# EAGLE design ArduinoStripShield (EAGLE 7.7.0)
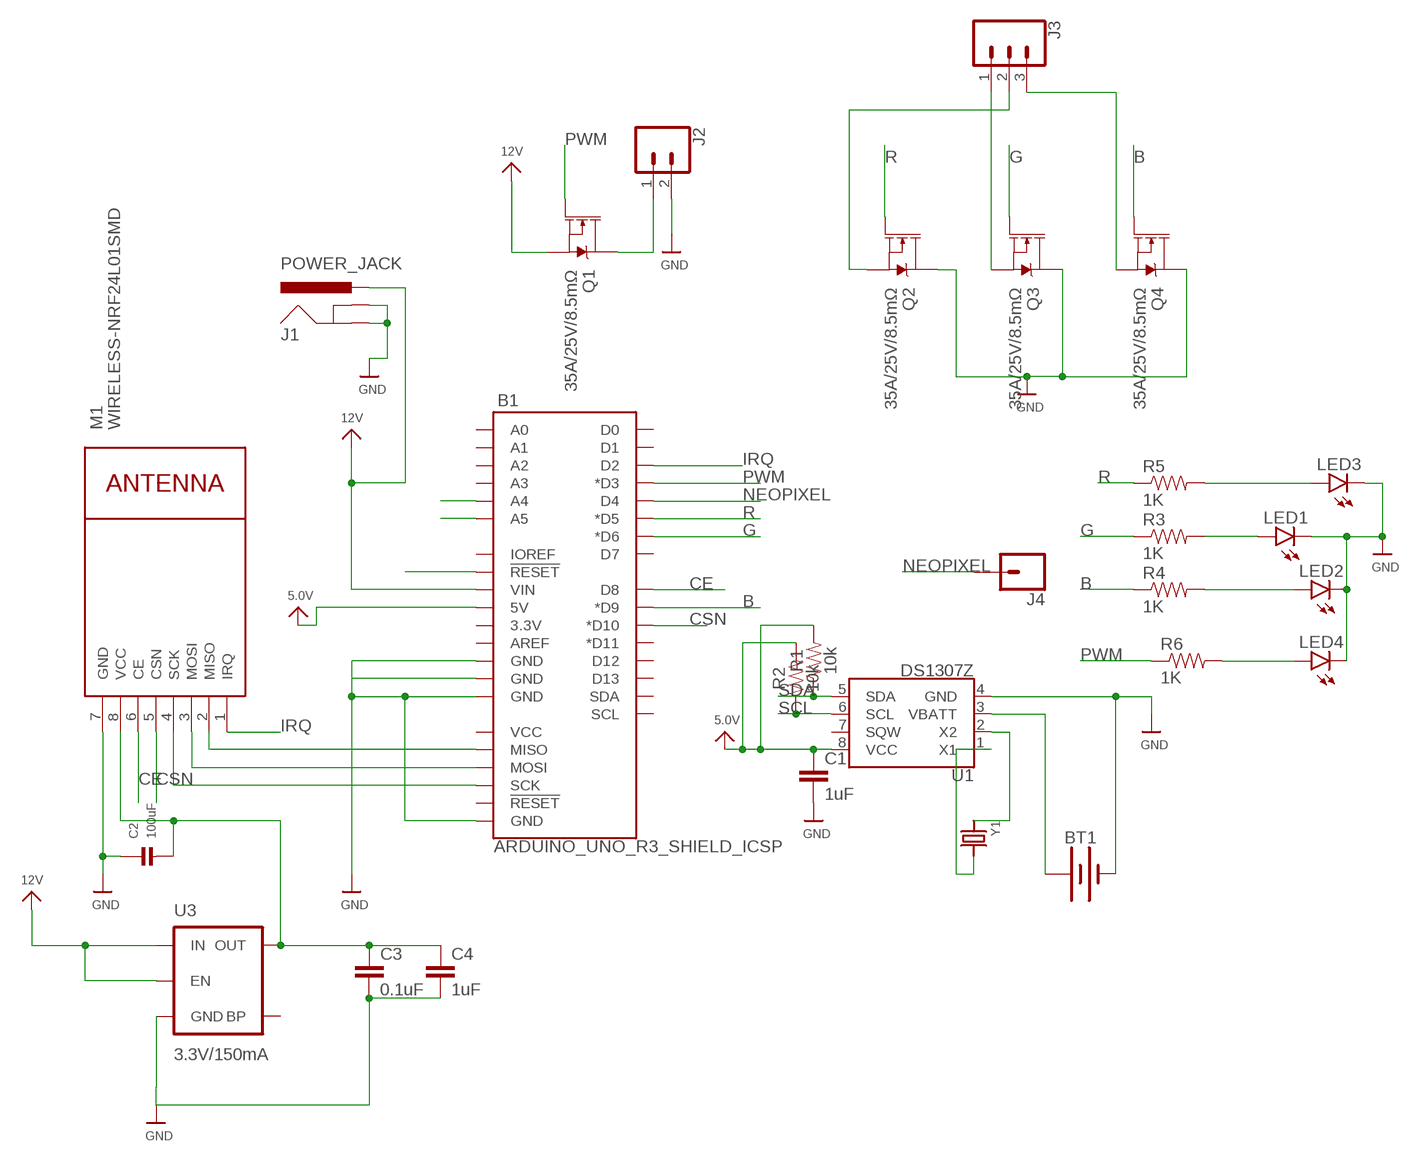
[diagram p0: schematic, sheet 1]

## Parts
B1  ARDUINO_UNO_R3_SHIELD_ICSP  [UNO_R3_SHIELD_ICSP]
BT1  BATTERY-12MM_SMD  [BATTCON_12MM]
C1  1uF  CAP  [0805]
C2  100uF  CAP_CERAMIC1206  [1206]
C3  0.1uF  CAP  [0805]
C4  1uF  CAP  [0805]
J1  POWER_JACK  [POWER_JACK_PTH]
J2  CONN_02  [1X02]
J3  CONN_03  [1X03]
J4  CONN_01  [1X01]
LED1  LED0603  [LED-0603]
LED2  LED0603  [LED-0603]
LED3  LED0603  [LED-0603]
LED4  LED0603  [LED-0603]
M1  WIRELESS-NRF24L01SMD  [WIRELESS-NRF24L01-SMD]
Q1  35A/25V/8.5mΩ  MOSFET-NCH-FDD8780  [DPAK]
Q2  35A/25V/8.5mΩ  MOSFET-NCH-FDD8780  [DPAK]
Q3  35A/25V/8.5mΩ  MOSFET-NCH-FDD8780  [DPAK]
Q4  35A/25V/8.5mΩ  MOSFET-NCH-FDD8780  [DPAK]
R1  10k  10KOHM-0603-1/10W-1%  [0603]
R2  10k  10KOHM-0603-1/10W-1%  [0603]
R3  1K  1KOHM-1/10W-1%(0603)  [0603-RES]
R4  1K  1KOHM-1/10W-1%(0603)  [0603-RES]
R5  1K  1KOHM-1/10W-1%(0603)  [0603-RES]
R6  1K  1KOHM-1/10W-1%(0603)  [0603-RES]
U1  DS1307Z  [SO08-0.15]
U3  3.3V/150mA  V_REG_MIC52053.3V  [SOT23-5]
Y1  CRYSTAL8X3.8SMT  [CRYSTAL_8X3.8]

## Nets
5.0V: B1.5V C1.1 R1.2 R2.2 U1.8(VCC)
12V: B1.VIN J1.PWR Q1.3(S) U3.1(IN) U3.3(EN)
B: B1.D9(*D9) Q4.1(G) R4.1
CE: B1.D8 M1.6(CE)
CSN: B1.D10(*D10) M1.5(CSN)
G: B1.D6(*D6) Q3.1(G) R3.1
GND: B1.GND@0(GND) B1.GND@1(GND) B1.GND@2(GND) B1.GND_ICSP(GND) BT1.GND(-) C1.2 C2.1 C3.2 C4.2 J1.GND J1.GNDBREAK J2.2 LED1.C LED2.C LED3.C LED4.C M1.7(GND) Q2.4(D) Q3.4(D) Q4.4(D) U1.4(GND) U3.2(GND)
IRQ: B1.D2 M1.1(IRQ)
N$1: J2.1 Q1.4(D)
N$2: B1.MISO M1.2(MISO)
N$3: B1.MOSI M1.3(MOSI)
N$4: J3.1 Q3.3(S)
N$5: J3.2 Q2.3(S)
N$6: J3.3 Q4.3(S)
N$7: BT1.PWR@1(+) U1.3(VBATT)
N$8: U1.2(X2) Y1.P$1
N$9: U1.1(X1) Y1.P$4
N$10: B1.SCK M1.4(SCK)
N$11: C2.2 C3.1 C4.1 M1.8(VCC) U3.5(OUT)
N$12: LED2.A R4.2
N$13: LED4.A R6.2
N$16: LED3.A R5.2
N$17: LED1.A R3.2
NEOPIXEL: B1.D4 J4.1
PWM: B1.D3(*D3) Q1.1(G) R6.1
R: B1.D5(*D5) Q2.1(G) R5.1
RST: B1.RES(!RESET!)
SCL: B1.A5 R2.1 U1.6(SCL)
SDA: B1.A4 R1.1 U1.5(SDA)
Unconnected: B1.3.3V B1.5V_ICSP(VCC) B1.A0 B1.A1 B1.A2 B1.A3 B1.AREF B1.D7 B1.D11(*D11) B1.D12 B1.D13 B1.IOREF B1.RST_ICSP(!RESET!) B1.RX(D0) B1.SCL B1.SDA B1.TX(D1) U1.7(SQW) U3.4(BP)

## Library data of the parts
B1 = SparkFun-Boards:ARDUINO_UNO_R3_SHIELD_ICSP: Arduino R3 Shield Footprint with ICSP Header Includes pins for 6-pin (2x3) ICSP Header. Compatible with Leonardo boards that require SPI pin connections via this header. SparkFun Products: CryptoShield <https://www.sparkfun.com/products/13183> microSD Shield <https://www.sparkfun.com/products/12761> R3 Stackable Headers Kit <https://www.sparkfun.com/products/1417>
BT1 = SparkFun-Batteries:BATTERY: Battery - Single Cell A variety of battery chemistries, sizes, and footprints. Device List: 20MM_PTH - Coin Cell Battery Holder - 20mm (PTH) <https://www.sparkfun.com/products/783> 12MM_SMD - Coin Cell Battery Holder - 12mm (SMD) <https://www.sparkfun.com/products/10592> 12MM_PTH - Coin Cell Battery Holder - 12mm (PTH) <https://www.sparkfun.com/products/7948> 20MM_SMD - 20mm Coin Cell Battery Holder (SMD) (2 legs) Used on the Big Time Watch Kit <https://www.sparkfun.com/products/11734> 20MM_SMD_4LEGS - Coin Cell Battery Holder - 20mm (SMD) <https://www.sparkfun.com/products/11892> 20MM_SMD_4LEGS_OVERPASTE - Coin Cell Battery Holder - 20mm (SMD) <https://www.sparkfun.com/products/11892> (Over-paste on the legs) 24.5MM_PTH - Coin Cell Battery Holder - 24.5mm (PTH) <https://www.sparkfun.com/products/8863> 9V - 9V Battery Holder - PC Mount Used on the SparkFun SparkPunk Sound Kit <https://www.sparkfun.com/products/11177> and SparkFun SparkPunk Sequencer Kit <https://www.sparkfun.com/products/12707> 18650 - Battery Holder - 18650 (PTH) <https://www.sparkfun.com/products/13113> AA - Battery Holder - 1xAA (PTH) <https://www.sparkfun.com/products/7949> AAA - Battery Holder - 1xAAA (PTH) <https://www.sparkfun.com/products/12718> AA_KIT - Battery Holder - 1xAA (PTH) <https://www.sparkfun.com/products/7949> Special kit package - pads only have exposed copper on one side of the board. AAA_KIT - Battery Holder - 1xAAA (PTH) <https://www.sparkfun.com/products/12718> Special kit package - pads only have exposed copper on one side of the board.; PROD_ID: BATT-08044; SF_SKU: PRT-10592
C1 C3 C4 = Ilya_Teach:CAP
C2 = microbuilder:CAP_CERAMIC: Ceramic Capacitors 0402 - 0402 Surface Mount Capacitors 16pF 50V 5% [Digikey: 445-4899-2-ND] 18pF 50V 5% [Digikey: 490-1281-2-ND] 22pF 50V 5% [Digikey: 490-1283-2-ND] 68pF 50V 5% [Digikey: 490-1289-2-ND] 0.1uF 10V 10% [Digikey: 490-1318-2-ND] 1.0uF 6.3V 10% [Digikey: 490-1320-2-ND] 0603 - 0603 Surface Mount Capacitors 16 pF 50V 5% [Digikey: 445-5051-2-ND] 22 pF 50V [Digikey: PCC220ACVTR-ND] 33 pF 50V 5% [Digikey: 490-1415-1-ND] 56pF 50V 5% [Digikey: 490-1421-1-ND] 220pF 50V 5% [Digikey: 445-1285-1-ND] 680 pF 50V 2200 pF 50V 5% C0G [Digikey: 445-1297-1-ND] 5600 pF 100V 5% X7R [Digikey: 478-3711-1-ND] 0.1 µF 25V 10% [Digikey: PCC2277TR-ND] 0.22 µF 16V 10% X7R [Digikey: 445-1318-1-ND] 1.0 µF 25V 10% [Digikey: 445-5146-2-ND] 0603 - RF Specific 3pF 250V +/-0.1pF RF [Digikey: 712-1347-1-ND] 18 pF 250V 5% [Digikey: 478-3505-1-ND or 712-1322-1-ND] 56 pF 250V 5% C0G RF [Digikey: 490-4867-1-ND] 68 pF 250V RF [Digikey: 490-4868-1-ND] 0805 - 0805 Surface Mount Capacitors 220 pF 250V 2% RF Ceramic Capacitor [Digikey: 712-1398-1-ND] 1000 pF 50V 2% NP0 Ceramic Capacitor [Digikey: 478-3760-1-ND] 0.1 µF 25V 10% Ceramic Capacitor [Digikey: PCC1828TR-ND] 1.0 µF 16V 10% Ceramic Capacitor[Digikey: 490-1691-2-ND] 10.0 µF 10V 10% Ceramic Capacitor[Digikey: 709-1228-1-ND] 10.0 uF 16V 10% Ceramic Capacitor [Digikey: 478-5165-2-ND] 47 uF 6.3V 20% Ceramic Capacitor [Digikey: 587-1779-1-ND or 399-5506-1-ND] 1206 - 1206 Surface Mount Capacitors 47uF 10V 20% Ceramic Capacitor [Digikey: 490-5528-1-ND or 399-5508-1-ND or 445-6010-1-ND] 100uF 6.3V -20%, +80% Y5V Ceramic Capacitor (Digikey: 490-4512-1-ND, Mouser: 81-GRM31CF50J107ZE1L)
J1 = SparkFun-Connectors:POWER_JACK: Power Jack Connector This is the standard 5.5mm barrel jack for power. The PTH is the most common, proven, reliable, footprint. The Slot footprint only works if the mill layer is transmitted to the PCB fab house so be warned. Here are the connectors we sell at SparkFun: DC Barrel Power Jack/Connector <https://www.sparkfun.com/products/119> (PRT-00119) DC Barrel Power Jack/Connector (SMD) <https://www.sparkfun.com/products/12748> (PRT-12748) DC Barrel Jack Adapter - Breadboard Compatible <https://www.sparkfun.com/products/10811> (PRT-10811) It is used on this SparkFun product (and many, many others): SparkFun RedBoard - Programmed with Arduino <https://www.sparkfun.com/products/12757> (DEV-12757) Also, if you need a mating power supply or connector, please check these out: Wall Adapter Power Supply - 9VDC 650mA <https://www.sparkfun.com/products/298> (TOL-00298) DC Barrel Jack Adapter - Male <https://www.sparkfun.com/products/10287> (PRT-10287); PROD_ID: CONN-08197
J2 = SparkFun-Connectors:CONN_02: Multi connection point. Often used as Generic Header-pin footprint for 0.1 inch spaced/style header connections On any of the 0.1 inch spaced packages, you can populate with these: Break Away Headers - Straight <https://www.sparkfun.com/products/116> (PRT-00116) Break Away Male Headers - Right Angle <https://www.sparkfun.com/products/553> (PRT-00553) Female Headers <https://www.sparkfun.com/products/115> (PRT-00115) Break Away Headers - Machine Pin <https://www.sparkfun.com/products/117> (PRT-00117) Break Away Female Headers - Swiss Machine Pin <https://www.sparkfun.com/products/743> (PRT-00743) For SCREWTERMINALS and SPRING TERMINALS visit here: Screw Terimnals on SparkFun.com <https://www.sparkfun.com/search/results?term=Screw+Terminals> (5mm/3.5mm/2.54mm spacing) This device is also useful as a general connection point to wire up your design to another part of your project. Our various solder wires solder well into these plated through hole pads. Hook-Up Wire - Assortment (Stranded, 22 AWG) <https://www.sparkfun.com/products/11375> (PRT-11375) Hook-Up Wire - Assortment (Solid Core, 22 AWG) <https://www.sparkfun.com/products/11367> (PRT-11367) View the entire wire category on our website here <https://www.sparkfun.com/categories/141> Special notes: Molex polarized connector foot print use with: PRT-08233 with associated crimp pins and housings. 2.54_SCREWTERM for use with PRT-10571. 3.5mm Screw Terminal footprints for PRT-08084 5mm Screw Terminal footprints for use with PRT-08432
J3 = SparkFun-Connectors:CONN_03: Multi connection point. Often used as Generic Header-pin footprint for 0.1 inch spaced/style header connections On any of the 0.1 inch spaced packages, you can populate with these: Break Away Headers - Straight <https://www.sparkfun.com/products/116> (PRT-00116) Break Away Male Headers - Right Angle <https://www.sparkfun.com/products/553> (PRT-00553) Female Headers <https://www.sparkfun.com/products/115> (PRT-00115) Break Away Headers - Machine Pin <https://www.sparkfun.com/products/117> (PRT-00117) Break Away Female Headers - Swiss Machine Pin <https://www.sparkfun.com/products/743> (PRT-00743) Stackable Header - 3 Pin (Female, 0.1") <https://www.sparkfun.com/products/13875> (PRT-13875) For SCREWTERMINALS and SPRING TERMINALS visit here: Screw Terimnals on SparkFun.com <https://www.sparkfun.com/search/results?term=Screw+Terminals> (5mm/3.5mm/2.54mm spacing) This device is also useful as a general connection point to wire up your design to another part of your project. Our various solder wires solder well into these plated through hole pads. Hook-Up Wire - Assortment (Stranded, 22 AWG) <https://www.sparkfun.com/products/11375> (PRT-11375) Hook-Up Wire - Assortment (Solid Core, 22 AWG) <https://www.sparkfun.com/products/11367> (PRT-11367) View the entire wire category on our website here <https://www.sparkfun.com/categories/141> Special notes: Molex polarized connector foot print use with SKU : PRT-08232 with associated crimp pins and housings.
J4 = SparkFun-Connectors:CONN_01: Single connection point. Often used as Generic Header-pin footprint for 0.1 inch spaced/style header connections On any of the 0.1 inch spaced packages, you can populate with these: Break Away Headers - Straight <https://www.sparkfun.com/products/116> (PRT-00116) Break Away Male Headers - Right Angle <https://www.sparkfun.com/products/553> (PRT-00553) Female Headers <https://www.sparkfun.com/products/115> (PRT-00115) Break Away Headers - Machine Pin <https://www.sparkfun.com/products/117> (PRT-00117) Break Away Female Headers - Swiss Machine Pin <https://www.sparkfun.com/products/743> (PRT-00743) This device is also useful as a general connection point to wire up your design to another part of your project. Our various solder wires solder well into these plated through hole pads. Hook-Up Wire - Assortment (Stranded, 22 AWG) <https://www.sparkfun.com/products/11375> (PRT-11375) Hook-Up Wire - Assortment (Solid Core, 22 AWG) <https://www.sparkfun.com/products/11367> (PRT-11367) View the entire wire category on our website here <https://www.sparkfun.com/categories/141> Special notes: SMTSO-256-ET is a "flush mount" nut for a 4-40 screw. We mostly use this on specialty testbeds; it is a nice way to connect hardware to your PCB at an adjustable hieght. Also note, the SNAP packages are for using a snappable style connector. We sell a baggie of snaps and they are also used on two LilyPad designs: Snap Assortment - 30 pack (male and female) <https://www.sparkfun.com/products/11347> (DEV-11347) LilyPad Arduino SimpleSnap <https://www.sparkfun.com/products/10941> (DEV-10941) LilyPad SimpleSnap Protoboard <https://www.sparkfun.com/products/10940> (DEV-10940)
LED1-LED4 = Ilya_Teach:LED: LEDs Standard schematic elements and footprints for 5mm, 3mm, 1206, and 0603 sized LEDs. 5mm - Spark Fun Electronics SKU : COM-00529 (and others)
M1 = nrf24l01plus:WIRELESS-NRF24L01: 2.4 GHz Wireless Module based on NRF24L01 chip
Q1-Q4 = SparkFun-DiscreteSemi:MOSFET-NCH: N-channel MOSFETs Voltage controlled devices that allow control of high current outputs. SparkFun Products: SparkFun OpenScale <https://www.sparkfun.com/products/13261> SparkFun Digital Sandbox <https://www.sparkfun.com/products/12651> SparkFun Monster Moto Shield <https://www.sparkfun.com/products/10182> SparkFun MOSFET Power Controller <https://www.sparkfun.com/products/11214>; PROD_ID: TRANS-09984
R1 R2 = SparkFun-Resistors:10KOHM: 10kΩ resistor A resistor is a passive two-terminal electrical component that implements electrical resistance as a circuit element. Resistors act to reduce current flow, and, at the same time, act to lower voltage levels within circuits. - Wikipedia; PROD_ID: RES-00824
R3-R6 = SparkFun-Resistors:1KOHM-1/10W-1%(0603): RES-07856; PROD_ID: RES-07856
U1 = SparkFun-Clocks:DS1307: Maxim DS1307 - I2C Real-time clock (RTC) The DS1307 serial real-time clock (RTC) is a low-power, full binary-coded decimal (BCD) clock/calendar plus 56 bytes of NV SRAM. Address and data are transferred serially through an I2C, bidirectional bus. The clock/calendar provides seconds, minutes, hours, day, date, month, and year information. SparkFun Products: Real Time Clock Module <https://www.sparkfun.com/products/12708> (BOB-12708) Datasheet <https://cdn.sparkfun.com/datasheets/BreakoutBoards/DS1307.pdf>; PROD_ID: IC-08138
U3 = SparkFun-PowerIC:V_REG_MIC5205: V_REG MIC5205 Standard 3.3V, 5V, and Adjustable 150mA LDO voltage regulator in SOT-23 layout. Micrel part MIC5205. BP (by-pass) pin is used to lower output noise with 470pF cap, may be left open. On the adjustable version BP is used to set output.; PROD_ID: VREG-00822
Y1 = microbuilder:CRYSTAL: Crystals HC49UP - Surface Mount Crystal 4.0MHz 18pF +/-30ppm Surface Mount Crystal [Digikey: 535-9857-1-ND] 12.0 MHz Surface Mount Crystal [Digikey: 535-9869-6-ND] 25.0 MHz Surface Mount Crystal [Digikey: 535-9078-1-ND] 2.5 x 2.0mm - MEMs SMT Crystal 16.0 MHz 10pF 20ppm 2.5 x 2.0mm Crystal [Digikey -40-85°C: 535-10923-1-ND] 3.2 x 2.5mm - MEMs SMT Crystal 12.0 MHz 8pF 15ppm 3.2 x 2.5mm Crystal [Digikey: -10-70°C: 644-1047-1-ND -40-125°C: 644-1128-1-ND] 16.0 MHz 8pF 15ppm 3.2 x 2.5mm Crystal [Digikey: -10-70°C: 644-1049-1-ND -40-125°C: 644-1129-2-ND] 16.0 MHz 10pF 10ppm 3.2 x 2.5mm Crystal [Digikey: 644-1100-1-ND] 27.12 MHz 18pF 30ppm 3.2 x 2.5mm Crystal [Digikey: 887-1424-1-ND] 27.12MHz 10pF 10ppm 3.2 x 2.5mm Crystal [Digikey: 887-1329-1-ND] 4.9 x 1.8mm - MEMs SMT Crystal 32.768 KHz 12.5pF 20ppm 4.9 x 1.8mm Crystal [Digikey: SE2415CT-ND] 8.0 x 3.8mm - Surface Mount Crystal 32.768kHz 12.5pF 20ppm -40°C-85°C [Digikey: 535-9166-2-ND] Cylinder 32.768KHz Cylinder Crystal (2x6mm body) [Ex. Digikey: 300-8341-2-ND]

## Board
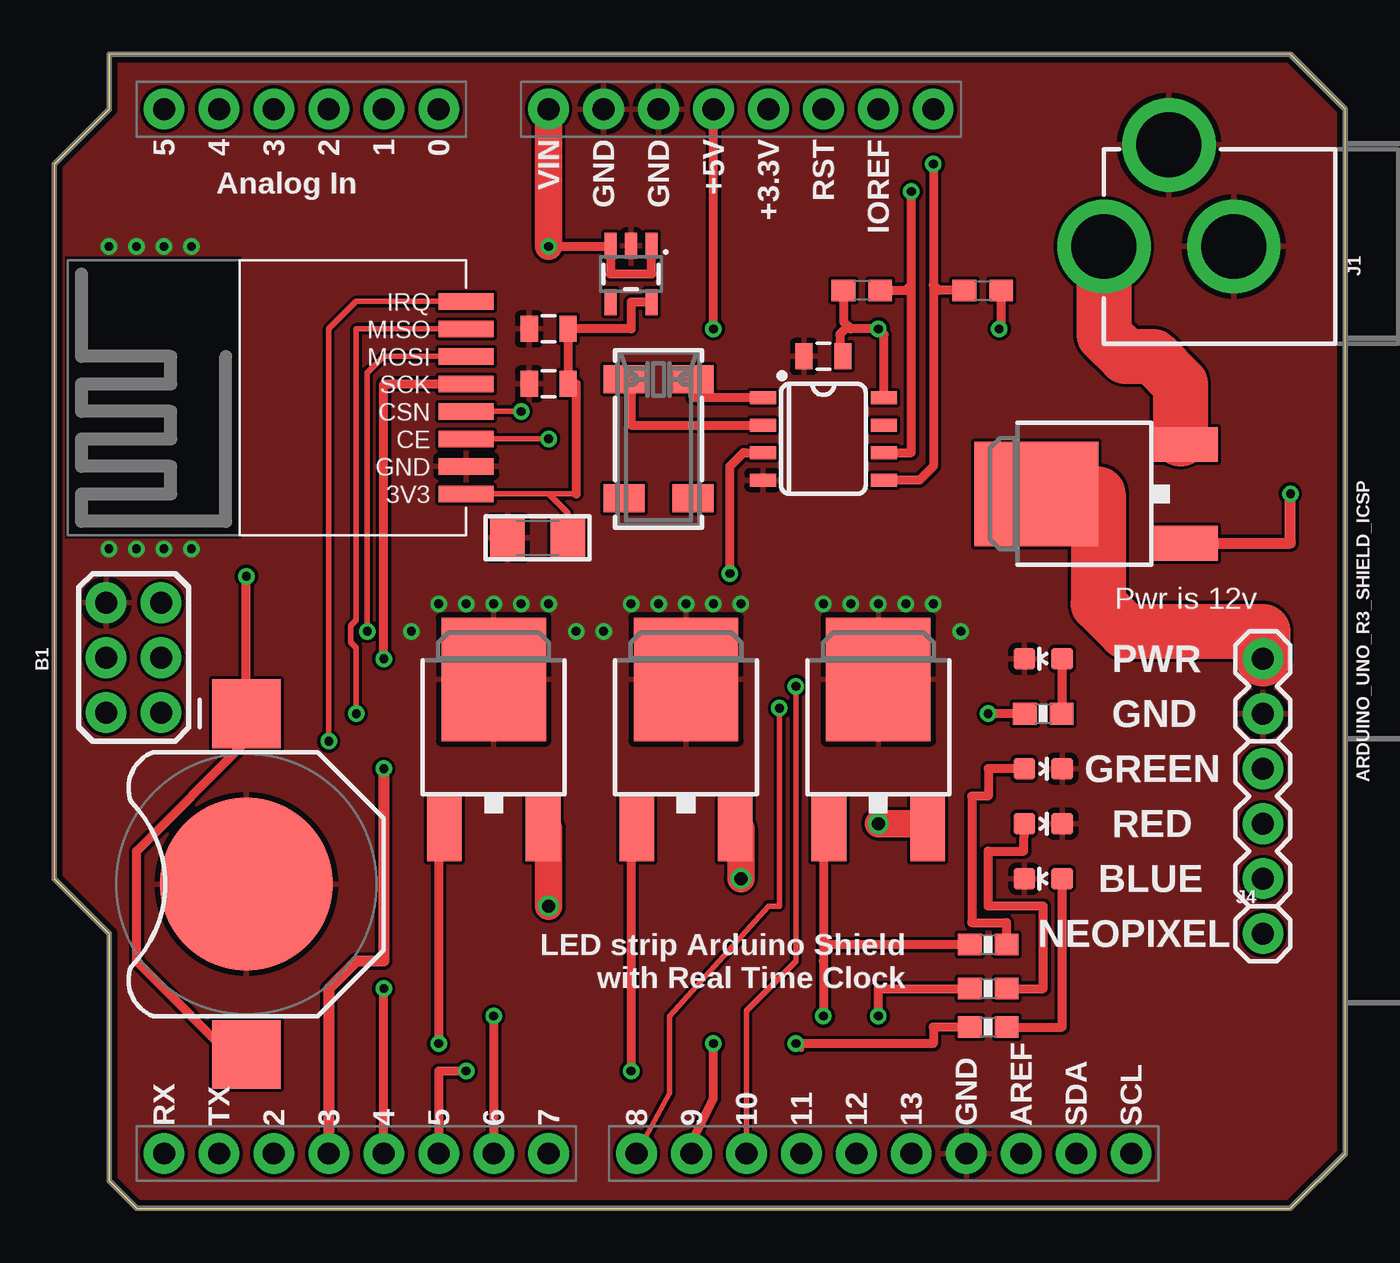
[diagram p1: board, top side]
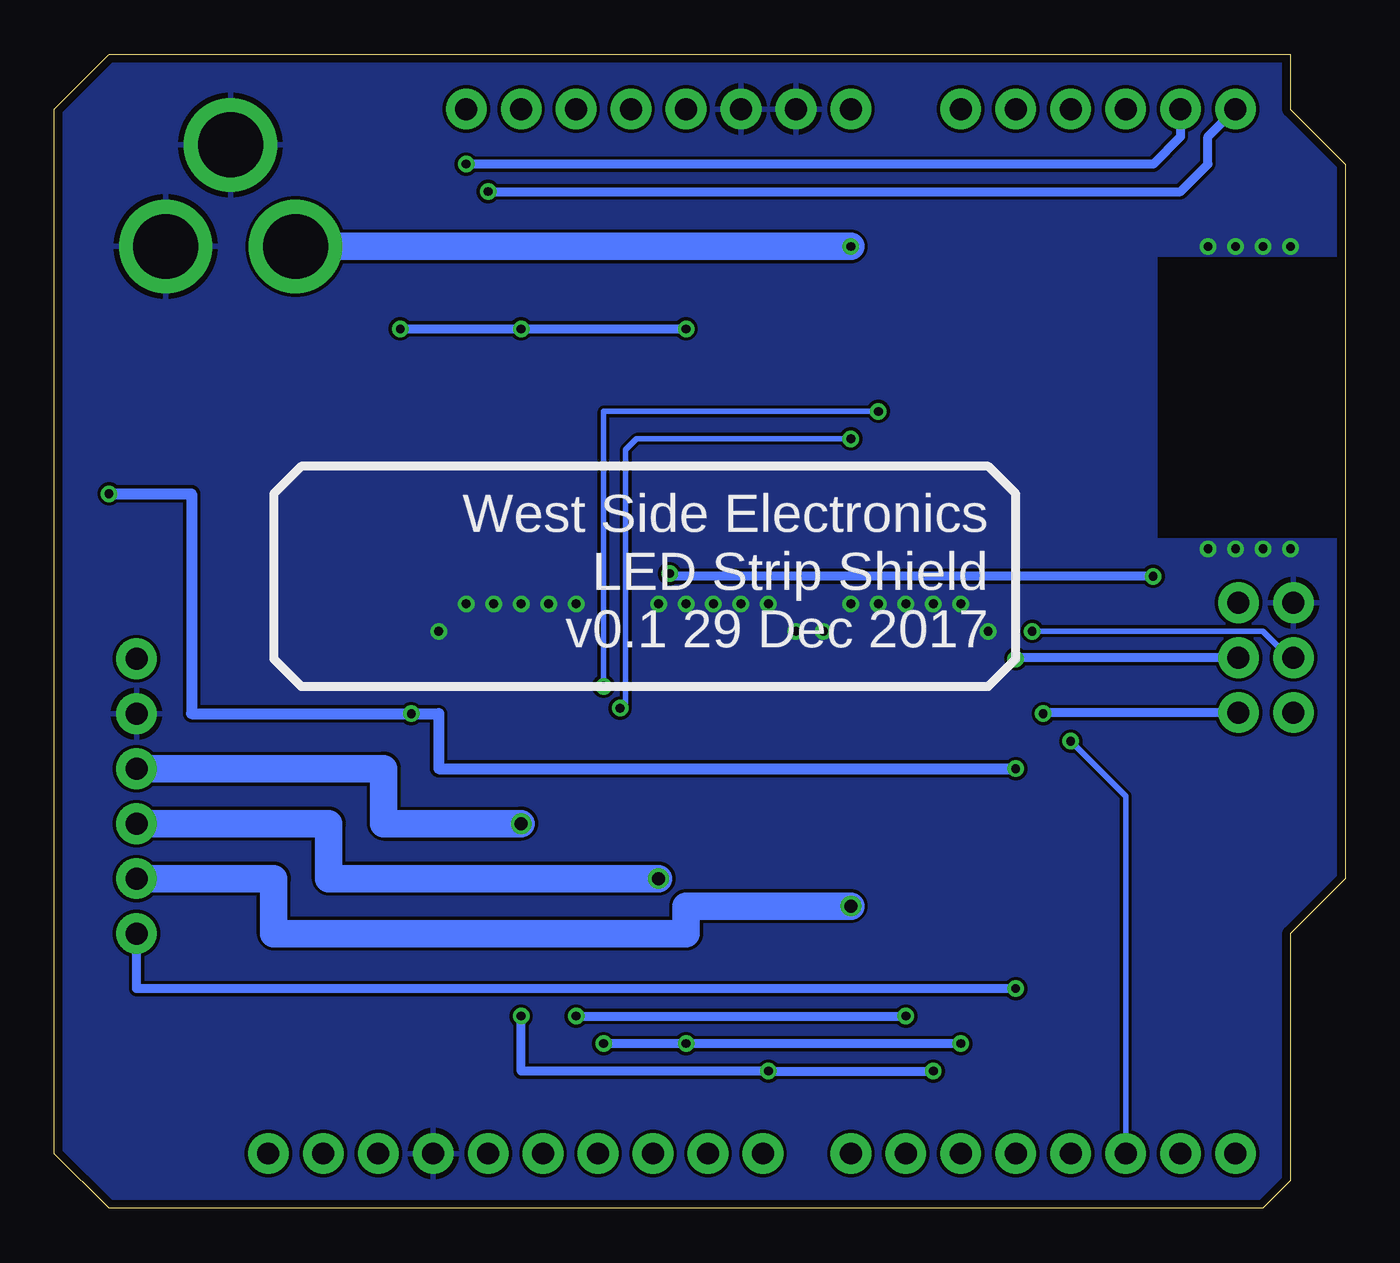
[diagram p2: board, bottom side, seen from below]

Size 59.69 x 53.34 mm. Coordinates in mm from the lower left corner, seen from the top.
Outline: 2.54,53.34 2.54,50.8 0,48.26 0,15.24 2.54,12.7 2.54,1.27 3.81,0 57.15,0 59.69,2.54 59.69,50.8 57.15,53.34 2.54,53.34
Copper layers (1*16): Top 0.0356mm / dielectric 1.5011mm / Bottom 0.0356mm
Design rules "LaenPCBOrder *": minimum track width 6mil, minimum drill 13mil, track to track 6mil, track to pad 6mil, pad to pad 6mil, via to via 6mil, smd to smd 6mil, copper to edge 15mil, drill to drill 6mil, minimum pad ring 7mil, minimum via ring 7mil, stop-mask expansion 3mil, vias tented up to drill 30mil, thermal gap 10mil
tRestrict: area 0.5,31 to 8.6,43.9
bRestrict: area 0.5,31 to 8.6,43.9

### Footprints (pad centres in the part's own frame; a part is rotated, then mirrored left to right if it is on the bottom)
UNO_R3_SHIELD_ICSP = drill 1.016 pad 1.88: 3.3V 24.13,-3.81; 5V 24.13,-1.27; 5V_ICSP -3.76,26.81; A0 24.13,11.43; A1 24.13,13.97; A2 24.13,16.51; A3 24.13,19.05; A4 24.13,21.59; A5 24.13,24.13; AREF -24.13,-15.494; D2 -24.13,19.05; D3 -24.13,16.51; D4 -24.13,13.97; D5 -24.13,11.43; D6 -24.13,8.89; D7 -24.13,6.35; D8 -24.13,2.286; D9 -24.13,-0.254; D10 -24.13,-2.794; D11 -24.13,-5.334; D12 -24.13,-7.874; D13 -24.13,-10.414; GND@0 24.13,1.27; GND@1 24.13,3.81; GND@2 -24.13,-12.954; GND_ICSP 1.32,26.81; IOREF 24.13,-8.89; MISO -3.76,24.27; MOSI -1.22,26.81; NC 24.13,-11.43; RES 24.13,-6.35; RST_ICSP 1.32,24.27; RX -24.13,24.13; SCK -1.22,24.27; SCL -24.13,-20.574; SDA -24.13,-18.034; TX -24.13,21.59; VIN 24.13,6.35
BATTCON_12MM = smd 8 x 8: GND 0,0 | smd 3.175 x 3.175: PWR@1 -7.874,0; PWR@2 7.874,0
0805 = smd 0.8 x 1.2: 1 -0.9,0; 2 0.9,0
1206 = smd 1.6 x 1.8: 1 -1.4,0; 2 1.4,0
POWER_JACK_PTH = drill 2.997 pad 4.318: GND 0,7.7; GNDBREAK 4.7,10.7; PWR 0,13.7
1X02 = drill 1.016 pad 1.88: 1 0,0; 2 2.54,0
1X03 = drill 1.016 pad 1.88: 1 0,0; 2 2.54,0; 3 5.08,0
1X01 = drill 1.016 pad 1.88: 1 0,0
LED-0603 = smd 1 x 1: A 0,-0.877; C 0,0.877
WIRELESS-NRF24L01-SMD = smd 2.54 x 0.762: 1 1.27,0; 2 1.27,1.27; 3 1.27,2.54; 4 1.27,3.81; 5 1.27,5.08; 6 1.27,6.35; 7 1.27,7.62; 8 1.27,8.89
DPAK = smd 1.6 x 3: 1 -2.28,-5.31; 3 2.28,-5.31 | smd 4.826 x 5.715: 4 0,1.588
0603 = smd 1.1 x 1: 1 -0.85,0; 2 0.85,0
0603-RES = smd 1.1 x 1: 1 -0.85,0; 2 0.85,0
SO08-0.15 = smd 0.6 x 1.2: 1 -1.905,-2.8; 2 -0.635,-2.8; 3 0.635,-2.8; 4 1.905,-2.8; 5 1.905,2.8; 6 0.635,2.8; 7 -0.635,2.8; 8 -1.905,2.8
SOT23-5 = smd 0.55 x 1.2: 1 -0.95,-1.3; 2 0,-1.3; 3 0.95,-1.3; 4 0.95,1.3; 5 -0.95,1.3
CRYSTAL_8X3.8 = smd 1.3 x 1.9: P$1 -2.75,-1.6; P$2 2.75,-1.6; P$3 2.75,1.6; P$4 -2.75,1.6

### Placement (x,y rotation side)
B1  29.21,26.67 90 top
BT1  8.89,14.99 90 top
C1  35.56,39.37 180 top
C2  22.35,30.99 0 top
C3  22.86,40.64 180 top
C4  22.86,38.1 180 top
J1  62.23,44.45 90 top
J2  55.88,25.4 270 top
J3  55.88,20.32 270 top
J4  55.88,12.7 0 top
LED1  45.72,20.32 270 top
LED2  45.72,15.24 90 top
LED3  45.72,17.78 270 top
LED4  45.72,25.4 90 top
M1  20.32,41.91 180 top
Q1  46.99,33.02 90 top
Q2  29.21,22.86 0 top
Q3  38.1,22.86 0 top
Q4  20.32,22.86 0 top
R1  42.93,42.42 0 top
R2  37.34,42.42 180 top
R3  43.18,12.19 0 top
R4  43.18,8.38 0 top
R5  43.18,10.16 0 top
R6  45.72,22.86 0 top
U1  35.56,35.56 270 top
U3  26.67,43.18 180 top
Y1  27.94,35.56 270 top

### Tracks (layer width: path | path; a pad name or v marks a point on that pad's centre or on a via)
5.0V  (via drill 0.41)
  Top 0.406: U1.8 38.36,40.38 v38.1,40.64 36.83,40.64 | v30.48,40.64 B1.5V | 36.83,40.64 36.58,40.64 36.32,40.39 36.32,39.51 C1.1 | R2.2 36.49,40.98 36.83,40.64 | R1.2 43.78,40.73 v43.69,40.64
  Bottom 0.406: v30.48,40.64 36.83,40.64 v38.1,40.64 v43.69,40.64
12V  (via drill 0.41)
  Top 0.406: v22.86,44.45 25.72,44.45 U3.3 25.72,43.18 27.62,43.18 U3.1
  Top 1.27: v22.86,44.45 B1.VIN | 52.07,35.56 52.07,35.53 Q1.3
  Top 2.54: J1.PWR 48.53,40.37 49.53,39.37 50.8,39.37 52.07,38.1 52.07,35.56
  Bottom 0.254: 48.26,44.45 J1.PWR
  Bottom 1.27: 48.26,44.45 v22.86,44.45
B  (via drill 0.41)
  Top 0.254: 34.54,7.37 v34.29,7.62
  Top 0.406: Q4.1 17.78,17.55 v17.78,7.62 | 34.54,7.62 v34.29,7.62 40.64,7.62 40.64,8.38 R4.1 | B1.D9 29.21,2.54 30.48,5.08 v30.48,7.62
  Bottom 0.406: v17.78,7.62 v30.48,7.62 v34.29,7.62
CE  (via drill 0.41)
  Top 0.254: M1.6 v22.86,35.56 | v33.53,23.11 33.53,13.97 33.02,13.97 28.45,8.89 28.45,5.33 B1.D8
  Bottom 0.254: v22.86,35.56 32.77,35.56 33.27,35.05 33.27,23.37 v33.53,23.11
CSN  (via drill 0.41)
  Top 0.254: B1.D10 32,9.14 34.29,11.43 v34.29,24.13 | v21.59,36.83 M1.5
  Bottom 0.254: v34.29,24.13 34.29,36.83 v21.59,36.83
G  (via drill 0.41)
  Top 0.406: Q3.1 35.56,17.55 35.56,12.19 | v35.56,8.89 35.56,11.43 35.56,12.19 | v20.32,8.89 B1.D6 | R3.1 35.56,12.19
  Bottom 0.406: v35.56,8.89 v20.32,8.89
GND  (via drill 0.41)
  other vias: 17.78,27.94 19.05,27.94 20.32,27.94 21.59,27.94 22.86,27.94 26.67,27.94 27.94,27.94 29.21,27.94 30.48,27.94 31.75,27.94 35.56,27.94 36.83,27.94 38.1,27.94 39.37,27.94 40.64,27.94 16.51,26.67 24.13,26.67 25.4,26.67 41.91,26.67 2.54,30.48 3.81,30.48 5.08,30.48 6.35,30.48 2.54,44.45 3.81,44.45 5.08,44.45 6.35,44.45
  pour Top: 2.54,54.61 58.42,54.61 60.96,52.07 60.96,2.54 57.15,-1.27 2.54,-1.27 1.27,0 1.27,11.43 -1.27,13.97 -1.27,48.26 1.27,50.8 1.27,53.34
  pour Bottom: 2.54,-1.27 57.15,-1.27 60.96,2.54 60.96,52.07 58.42,54.61 -1.27,53.34 -1.27,13.97 1.27,11.43 1.27,0
IRQ  (via drill 0.41)
  Top 0.254: v12.7,21.59 12.7,40.64 13.97,41.91 M1.1
  Bottom 0.254: B1.D2 10.16,19.05 v12.7,21.59
N$1
  Top 2.54: Q1.4 48.26,33.02 48.26,27.94 49.53,26.67 55.88,26.67 J2.1
N$2  (via drill 0.41)
  Top 0.254: v13.97,22.86 13.97,25.91 13.72,26.16 13.72,26.92 13.97,27.18 13.97,40.64 M1.2
  Bottom 0.406: B1.MISO 13.92,22.91 v13.97,22.86
N$3  (via drill 0.41)
  Top 0.254: v14.48,26.67 14.48,38.61 15.24,39.37 M1.3
  Bottom 0.152: B1.MOSI 2.59,25.45
  Bottom 0.254: v14.48,26.67 3.81,26.67 2.59,25.45
N$4  (via drill 0.6)
  Top 1.27: v38.1,17.78 40.38,17.78 Q3.3
  Bottom 1.27: J3.1 44.45,20.32 44.45,17.78 v38.1,17.78
N$5  (via drill 0.6)
  Top 1.27: v31.75,15.24 31.75,17.55 Q2.3
  Bottom 1.27: v31.75,15.24 46.99,15.24 46.99,17.78 J3.2
N$6  (via drill 0.6)
  Top 1.27: Q4.3 22.86,17.55 v22.86,13.97
  Bottom 1.27: v22.86,13.97 30.48,13.97 30.48,12.7 49.53,12.7 49.53,15.24 J3.3
N$7  (via drill 0.41)
  Top 0.406: BT1.PWR@1 8.89,6.35 3.81,11.43 3.81,16.51 8.89,21.59 v8.89,29.21 | v31.24,29.34 31.24,34.29 31.88,34.92 U1.3
  Bottom 0.406: v8.89,29.21 31.12,29.21 v31.24,29.34
N$8
  Top 0.406: Y1.P$1 26.67,38.31 26.67,36.2 U1.2
N$9
  Top 0.406: U1.1 29.54,37.46 Y1.P$4
N$10  (via drill 0.41)
  Top 0.406: v15.24,25.4 15.24,38.1 M1.4
  Bottom 0.406: B1.SCK 15.19,25.45 v15.24,25.4
N$11
  Top 0.254: M1.8 22.86,33.02 | 22.86,33.02 24.13,33.02 | C2.2 23.75,32.13 22.86,33.02
  Top 0.406: U3.5 26.67,41.88 26.67,40.64 C3.1 C4.1 24.13,38.1 24.13,33.02
N$12
  Top 0.406: R4.2 46.6,8.38 LED2.A
N$13
  Top 0.406: R6.2 46.6,22.86 LED4.A
N$16
  Top 0.406: R5.2 45.72,10.16 45.72,13.97 43.18,13.97 43.18,16.51 44.82,16.51 LED3.A
N$17
  Top 0.406: LED1.A 43.18,20.32 43.18,19.05 42.42,19.05 42.42,13.21 44.03,13.21 R3.2
NEOPIXEL  (via drill 0.41)
  Top 0.406: B1.D4 v15.24,10.16
  Bottom 0.406: v15.24,10.16 55.88,10.16 J4.1
PWM  (via drill 0.41)
  Top 0.406: R6.1 v43.18,22.86
  Top 0.508: Q1.1 57.15,30.74 v57.15,33.02 | v15.24,20.32 15.24,11.43 13.97,11.43 12.7,10.16 B1.D3
  Bottom 0.508: v57.15,33.02 53.34,33.02 53.34,22.86 v43.18,22.86 41.91,22.86 41.91,20.32 v15.24,20.32
R  (via drill 0.41)
  Top 0.406: Q2.1 26.67,17.55 v26.67,6.35 | v19.05,6.35 17.78,6.35 B1.D5 | v38.1,8.89 38.1,10.16 R5.1
  Bottom 0.406: v19.05,6.35 v26.67,6.35 38.1,6.35 v38.1,8.89
SCL  (via drill 0.41)
  Top 0.406: U1.6 39.62,34.92 39.62,42.67 | 39.62,42.67 v39.62,46.99 | R2.1 39.37,42.42 39.62,42.67
  Bottom 0.406: v39.62,46.99 7.62,46.99 6.35,48.26 6.35,49.53 B1.A5
SDA  (via drill 0.41)
  Top 0.406: v40.64,48.26 40.64,42.67 | 40.64,42.67 40.64,34.29 40.01,33.66 U1.5 | R1.1 40.89,42.42 40.64,42.67
  Bottom 0.406: v40.64,48.26 8.89,48.26 7.62,49.53 B1.A4

### Text on the board
tPlace: Pwr is 12v | PWR | GND | GREEN | RED | BLUE | LED strip Arduino Shield / with Real Time Clock | NEOPIXEL
bPlace: West Side Electronics / LED Strip Shield / v0.1 29 Dec 2017